# EAGLE design valoohj (EAGLE 7.2.0)
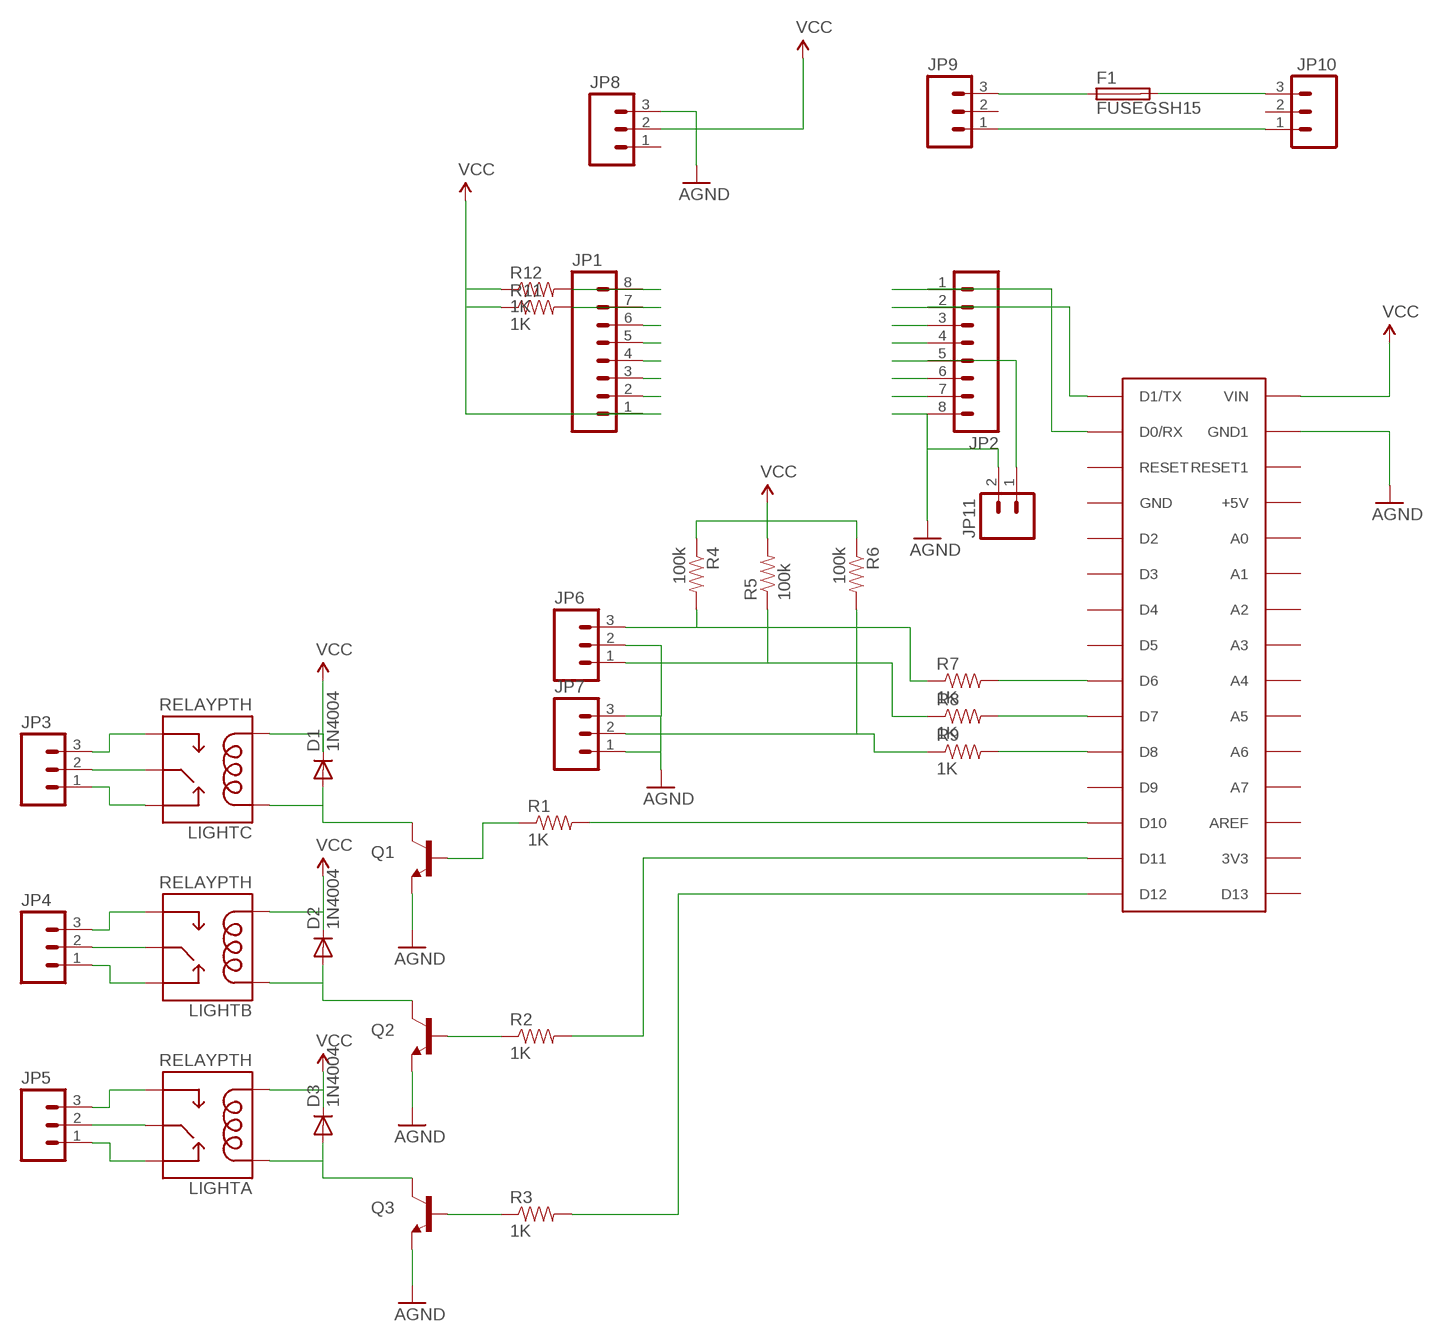
[diagram p0: schematic, sheet 1]

## Parts
D1  1N4004  [DO41-10]
D2  1N4004  [DO41-10]
D3  1N4004  [DO41-10]
F1  FUSEGSH15  [GSH15]
JP1  M08LONGPADS  [1X08_LONGPADS]
JP2  M08LONGPADS  [1X08_LONGPADS]
JP3  M03-SCREW-5MM  [SCREWTERMINAL-5MM-3]
JP4  M03-SCREW-5MM  [SCREWTERMINAL-5MM-3]
JP5  M03-SCREW-5MM  [SCREWTERMINAL-5MM-3]
JP6  M03-SCREW-5MM  [SCREWTERMINAL-5MM-3]
JP7  M03-SCREW-5MM  [SCREWTERMINAL-5MM-3]
JP8  M03SCREW  [SCREWTERMINAL-3.5MM-3]
JP9  M03SCREW  [SCREWTERMINAL-3.5MM-3]
JP10  M03SCREW  [SCREWTERMINAL-3.5MM-3]
JP11  M02LOCK  [1X02_LOCK]
LIGHTA  RELAYPTH  [SRD-05VDC-SL-C]
LIGHTB  RELAYPTH  [SRD-05VDC-SL-C]
LIGHTC  RELAYPTH  [SRD-05VDC-SL-C]
Q1  TRANSISTOR_NPNBC547  [TO-92-AMMO]
Q2  TRANSISTOR_NPNBC547  [TO-92-AMMO]
Q3  TRANSISTOR_NPNBC547  [TO-92-AMMO]
R1  1K  1KOHM-1/4W-1%(PTH)  [AXIAL-0.3]
R2  1K  1KOHM-1/4W-1%(PTH)  [AXIAL-0.3]
R3  1K  1KOHM-1/4W-1%(PTH)  [AXIAL-0.3]
R4  100k  1KOHM-1/4W-1%(PTH)  [AXIAL-0.3]
R5  100k  1KOHM-1/4W-1%(PTH)  [AXIAL-0.3]
R6  100k  1KOHM-1/4W-1%(PTH)  [AXIAL-0.3]
R7  1K  1KOHM-1/4W-1%(PTH)  [AXIAL-0.3]
R8  1K  1KOHM-1/4W-1%(PTH)  [AXIAL-0.3]
R9  1K  1KOHM-1/4W-1%(PTH)  [AXIAL-0.3]
R11  1K  1KOHM-1/4W-1%(PTH)  [AXIAL-0.3]
R12  1K  1KOHM-1/4W-1%(PTH)  [AXIAL-0.3]
U$2  ARDUINONANO  [PDIP-32]

## Nets
AGND: JP2.8 JP6.2 JP7.1 JP7.3 JP8.3 JP11.2 Q1.3(E) Q2.3(E) Q3.3(E) U$2.GND1
N$1: R2.P$2 U$2.D11
N$2: F1.2 JP10.3
N$3: F1.1 JP9.3
N$4: JP9.1 JP10.1
N$5: JP1.8 R12.P$2
N$6: JP1.7 R11.P$2
N$7: JP1.6
N$8: JP1.5
N$9: JP1.4
N$10: JP1.3
N$11: JP1.2
N$12: D1.A LIGHTC.COIL1 Q1.1(C)
N$13: JP2.1 U$2.D0/RX
N$14: JP2.2 U$2.D1/TX
N$15: JP2.3
N$16: JP2.4
N$17: JP2.5 JP11.1
N$18: JP2.6
N$19: JP2.7
N$20: D2.A LIGHTB.COIL1 Q2.1(C)
N$21: R1.P$2 U$2.D10
N$22: Q1.2(B) R1.P$1
N$23: D3.A LIGHTA.COIL1 Q3.1(C)
N$24: R9.P$2 U$2.D8
N$25: Q2.2(B) R2.P$1
N$26: Q3.2(B) R3.P$1
N$27: R3.P$2 U$2.D12
N$28: R8.P$2 U$2.D7
N$29: R7.P$2 U$2.D6
N$30: JP6.3 R4.P$2 R7.P$1
N$31: JP6.1 R5.P$1 R8.P$1
N$32: JP7.2 R6.P$2 R9.P$1
N$33: JP3.3 LIGHTC.SWOPEN
N$34: JP3.2 LIGHTC.SWCOMMON
N$35: JP3.1 LIGHTC.SWCLOSED(SWCLOSE)
N$36: JP4.3 LIGHTB.SWOPEN
N$37: JP4.2 LIGHTB.SWCOMMON
N$38: JP4.1 LIGHTB.SWCLOSED(SWCLOSE)
N$39: JP5.3 LIGHTA.SWOPEN
N$40: JP5.2 LIGHTA.SWCOMMON
N$41: JP5.1 LIGHTA.SWCLOSED(SWCLOSE)
VCC: D1.C D2.C D3.C JP1.1 JP8.2 LIGHTA.COIL0 LIGHTB.COIL0 LIGHTC.COIL0 R4.P$1 R5.P$2 R6.P$1 R11.P$1 R12.P$1 U$2.VIN
Unconnected: JP8.1 JP9.2 JP10.2 U$2.3V3 U$2.+5V U$2.A0 U$2.A1 U$2.A2 U$2.A3 U$2.A4 U$2.A5 U$2.A6 U$2.A7 U$2.AREF U$2.D2 U$2.D3 U$2.D4 U$2.D5 U$2.D9 U$2.D13 U$2.GND U$2.RESET U$2.RESET1

## Library data of the parts
D1-D3 = adafruit:1N4004: DIODE General purpose 1N400x type rectifier (With bigger pads) http://www.ladyada.net/library/pcb/eaglelibrary.html
F1 = fuse:FUSE: Fuse; OC_FARNELL: unknown; OC_NEWARK: unknown
JP1 JP2 = SparkFun-Connectors:M08: Header 8 Standard 8-pin 0.1" header. Use with straight break away headers (SKU : PRT-00116), right angle break away headers (PRT-00553), swiss pins (PRT-00743), machine pins (PRT-00117), and female headers (PRT-00115).
JP3-JP7 = SparkFun-Connectors:M03: Header 3 Standard 3-pin 0.1" header. Use with straight break away headers (SKU : PRT-00116), right angle break away headers (PRT-00553), swiss pins (PRT-00743), machine pins (PRT-00117), and female headers (PRT-00115). Molex polarized connector foot print use with SKU : PRT-08232 with associated crimp pins and housings.; STOREFRONT_ID: PRT-08433
JP8-JP10 = SparkFun-Connectors:M03: Header 3 Standard 3-pin 0.1" header. Use with straight break away headers (SKU : PRT-00116), right angle break away headers (PRT-00553), swiss pins (PRT-00743), machine pins (PRT-00117), and female headers (PRT-00115). Molex polarized connector foot print use with SKU : PRT-08232 with associated crimp pins and housings.
JP11 = SparkFun-Connectors:M02: Standard 2-pin 0.1" header. Use with - straight break away headers ( PRT-00116) - right angle break away headers (PRT-00553) - swiss pins (PRT-00743) - machine pins (PRT-00117) - female headers (PRT-00115) Molex polarized connector foot print use with: PRT-08233 with associated crimp pins and housings. 2.54_SCREWTERM for use with PRT-10571. 3.5mm Screw Terminal footprints for PRT-08084 5mm Screw Terminal footprints for use with PRT-08432
LIGHTA LIGHTB LIGHTC = SRD-05VDC-SL-C:RELAY: SPDT relay (COM-00101)
Q1-Q3 = SparkFun-DiscreteSemi:TRANSISTOR_NPN: Generic NPN BJT MMBT2222A - TRANS-08049 (SOT-23, 1A 40V) MPSA42 - TRANS-09116 (SOT-23, 500mA 300V) MMBT5088LT1G - TRANS-11160 (SOT-23, 50 mA 30V) BC547 - COM-08928 <http://www.sparkfun.com/products/8928> (TO-92 45V 100mA) (1.Collector 2.Base 3.Emitter) 2N3904 - COM-00521 <http://www.sparkfun.com/products/521> (TO-92 40V 200mA) (1.Emitter 2.Base 3.Collector) P2N2222A - COM-12852 <http://www.sparkfun.com/products/12852> (TO-92 40V 600mA) (1.Collector 2.Base 3.Emitter)
R1-R3 R7-R9 R11 R12 = SparkFun-Resistors:1KOHM-1/4W-1%(PTH): RES-12182; PROD_ID: RES-12182
R4-R6 = SparkFun-Resistors:1KOHM-1/4W-1%(PTH): RES-12182; PROD_ID: RES-12182; VALUE: 1K
U$2 = jet-lib:ARDUINONANO

## Board
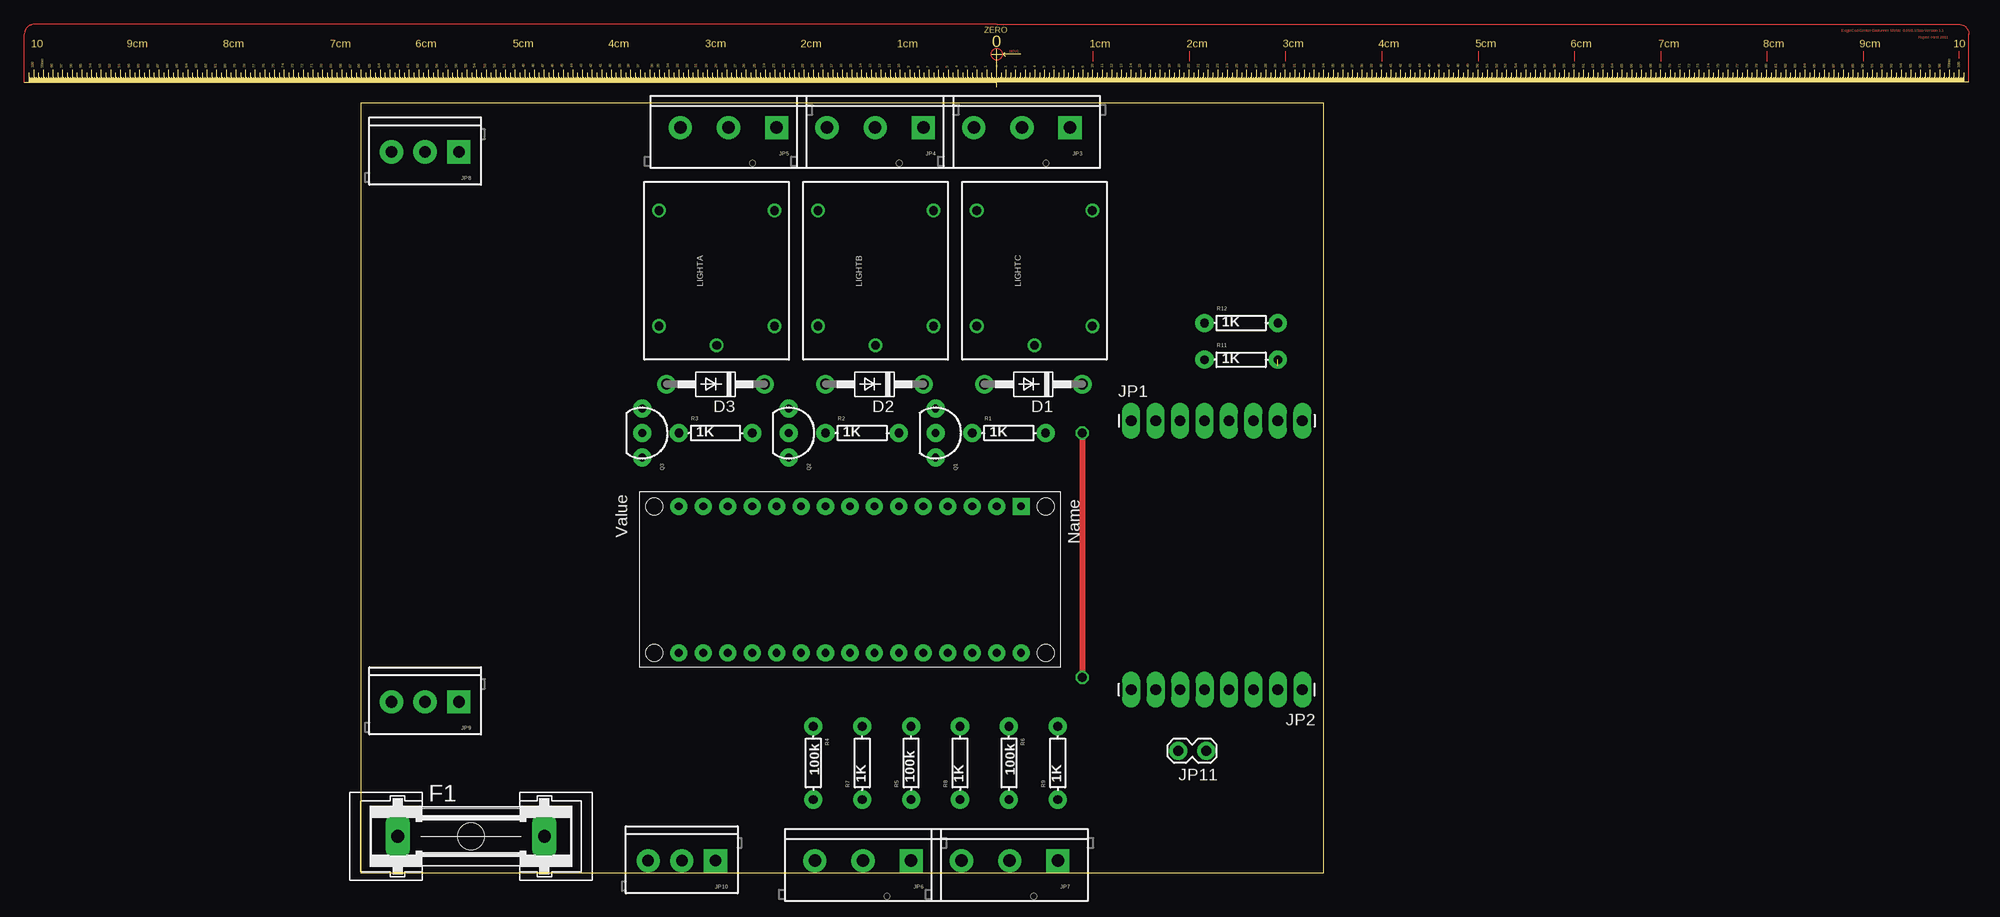
[diagram p1: board, top side]
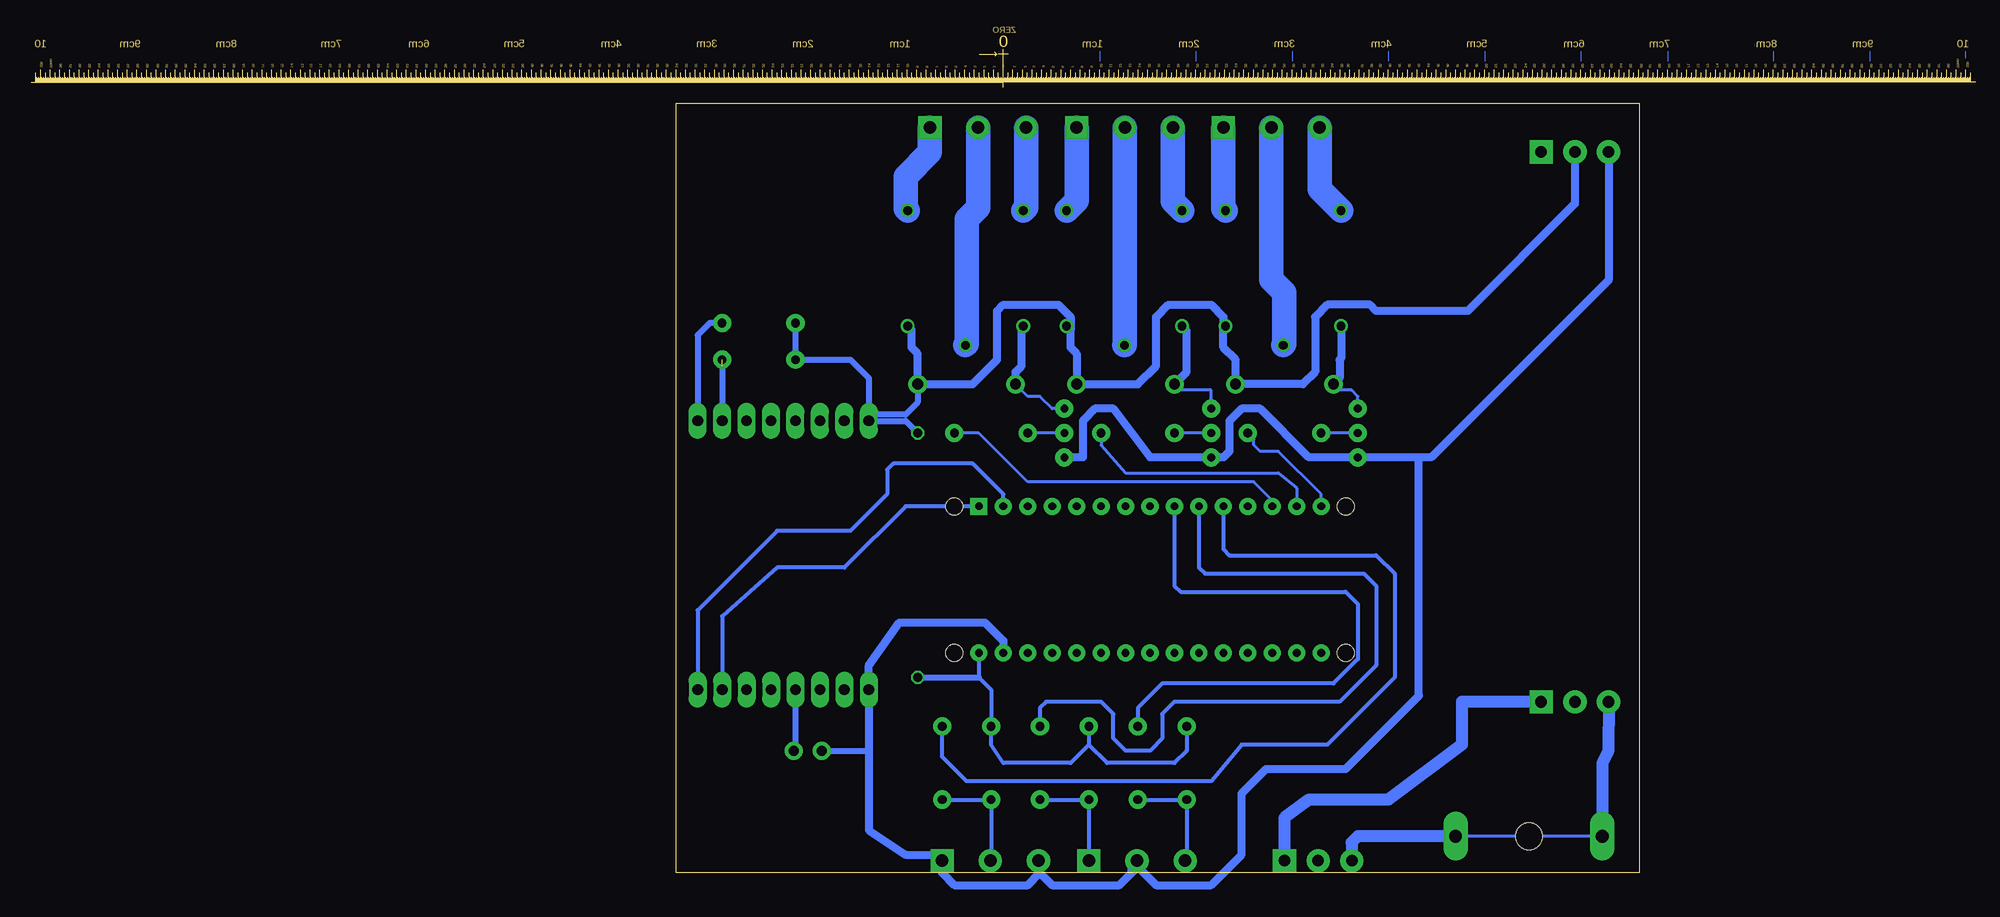
[diagram p2: board, bottom side, seen from below]

Size 100 x 80 mm. Coordinates in mm from the lower left corner, seen from the top.
Outline: 0,0 100,0 100,80 0,80 0,0
Copper layers (1*16): Top 0.035mm / dielectric 1.5mm / Bottom 0.035mm
Design rules "default": minimum track width 10mil, minimum drill 24mil, track to track 8mil, track to pad 8mil, pad to pad 8mil, via to via 8mil, smd to smd 8mil, copper to edge 40mil, drill to drill 8mil, minimum pad ring 10mil, minimum via ring 8mil, stop-mask expansion 4mil, vias tented up to drill 0mil, thermal gap 10mil

### Footprints (pad centres in the part's own frame; a part is rotated, then mirrored left to right if it is on the bottom)
DO41-10 = drill 1.118 pad 1.93: A 5.08,0; C -5.08,0
GSH15 = drill 1.321 pad 2.54 long: 1 -7.62,0; 2 7.62,0 | hole 2.794: 0,0
1X08_LONGPADS = drill 1.118 pad 1.88 long: 1 0,0; 2 2.54,0; 3 5.08,0; 4 7.62,0; 5 10.16,0; 6 12.7,0; 7 15.24,0; 8 17.78,0
SCREWTERMINAL-5MM-3 = drill 1.3 pad 2.413 square: 1 0,0 | drill 1.3 pad 2.413: 2 5,0; 3 10,0
SCREWTERMINAL-3.5MM-3 = drill 1.2 pad 2.413 square: 1 0,0 | drill 1.2 pad 2.413: 2 3.5,0; 3 7,0
1X02_LOCK = drill 1.016 pad 1.88: 1 -0.178,0; 2 2.718,0
SRD-05VDC-SL-C = drill 0.9: COIL0 -5.39,-6.12; COIL1 -5.39,5.88; SWCLOSED 6.61,-6.12; SWCOMMON -7.39,-0.12; SWOPEN 6.61,5.88
TO-92-AMMO = drill 0.813 pad 1.88: 1 -2.54,0; 2 0,0; 3 2.54,0
AXIAL-0.3 = drill 0.9 pad 1.88: P$1 -3.81,0; P$2 3.81,0
PDIP-32 = drill 0.8 pad 1.778: 3V3 15.24,-35.56; +5V 15.24,-10.16; A0 15.24,-12.7; A1 15.24,-15.24; A2 15.24,-17.78; A3 15.24,-20.32; A4 15.24,-22.86; A5 15.24,-25.4; A6 15.24,-27.94; A7 15.24,-30.48; AREF 15.24,-33.02; D0/RX 0,-5.08; D2 0,-12.7; D3 0,-15.24; D4 0,-17.78; D5 0,-20.32; D6 0,-22.86; D7 0,-25.4; D8 0,-27.94; D9 0,-30.48; D10 0,-33.02; D11 0,-35.56; D12 0,-38.1; D13 15.24,-38.1; GND 0,-10.16; GND1 15.24,-5.08; RESET 0,-7.62; RESET1 15.24,-7.62; VIN 15.24,-2.54 | drill 0.8 pad 1.778 square: D1/TX 0,-2.54 | hole 1.778: 0,0; 0,-40.64; 15.24,-40.64; 15.24,0

### Placement (x,y rotation side)
D1  69.85,50.8 180 top
D2  53.34,50.8 180 top
D3  36.83,50.8 180 top
F1  11.43,3.81 0 top
JP1  80.01,46.99 0 top
JP2  97.79,19.05 180 top
JP3  73.66,77.47 180 top
JP4  58.42,77.47 180 top
JP5  43.18,77.47 180 top
JP6  57.15,1.27 180 top
JP7  72.39,1.27 180 top
JP8  10.16,74.93 180 top
JP9  10.16,17.78 180 top
JP10  36.83,1.27 180 top
JP11  87.63,12.7 180 top
LIGHTA  36.83,62.23 90 top
LIGHTB  53.34,62.23 90 top
LIGHTC  69.85,62.23 90 top
Q1  59.69,45.72 270 top
Q2  44.45,45.72 270 top
Q3  29.21,45.72 270 top
R1  67.31,45.72 0 top
R2  52.07,45.72 0 top
R3  36.83,45.72 0 top
R4  46.99,11.43 270 top
R5  57.15,11.43 90 top
R6  67.31,11.43 270 top
R7  52.07,11.43 90 top
R8  62.23,11.43 90 top
R9  72.39,11.43 90 top
R11  91.44,53.34 0 top
R12  91.44,57.15 0 top
U$2  71.12,38.1 270 top
U$4  [RULER]  66.04,85.09 0 top  (outside the outline)

### Tracks (layer width: path | path; a pad name or v marks a point on that pad's centre or on a via)
AGND
  Bottom 0.61: JP11.2 80.01,12.7
  Bottom 0.813: JP8.3 3.16,61.61 21.59,43.18 22.86,43.18 | 22.86,43.18 Q3.3 34.29,43.18 39.37,48.26 41.27,48.26 42.55,46.99 42.55,43.81 43.18,43.18 Q2.3 50.8,43.18 54.61,48.26 56.52,48.26 57.78,46.99 57.78,43.18 Q1.3 | 62.23,0 62.23,1.11 | 62.23,1.11 JP7.3 62.39,0.16 62.23,0 | 52.7,0 53.98,-1.27 60.96,-1.27 62.23,0 | 52.7,0 52.7,0.71 JP6.2 | 62.23,0 63.5,-1.27 71.12,-1.27 72.39,0 JP7.1 73.03,1.91 76.2,1.91 80.01,4.45 80.01,12.7 JP2.8 80.01,21.59 76.83,26.04 67.94,26.04 66.04,24.13 U$2.GND1 | 62.23,1.27 62.23,1.11 | 52.7,0 52.07,0.64 50.16,-1.27 44.45,-1.27 41.27,1.91 41.27,8.26 38.73,10.79 30.48,10.79 22.86,18.41 22.86,43.18
N$1
  Bottom 0.305: R2.P$2 55.88,44.45 53.34,41.59 37.47,41.59 35.56,40.01 U$2.D11
N$2
  Bottom 1.27: F1.2 29.21,3.81 29.84,3.17 JP10.3
N$3
  Bottom 0.305: F1.1 19.05,3.81
  Bottom 1.27: JP9.3 3.17,12.7 3.81,11.43 F1.1 3.81,3.17
N$4
  Bottom 1.27: JP9.1 18.41,17.78 18.41,13.34 26.04,7.62 34.29,7.62 36.83,5.71 JP10.1
N$5
  Bottom 0.61: R12.P$2 96.52,57.15 97.79,55.88 JP1.8
N$6  (1 unrouted)
  Bottom 0.61: 95.25,52.7 JP1.7
N$12
  Bottom 0.305: Q1.1 60.96,48.26 62.23,49.53 63.5,49.53 D1.A
  Bottom 0.813: D1.A 64.77,52.07 64.14,52.7 64.14,56.67 LIGHTC.COIL1
N$13
  Bottom 0.406: U$2.D0/RX 66.04,39.37 69.22,42.55 77.47,42.55 78.11,41.91 78.11,39.37 81.92,35.56 89.53,35.56 97.79,27.3 JP2.1
N$14
  Bottom 0.406: U$2.D1/TX 76.2,38.1 82.55,31.75 89.53,31.75 95.25,26.67 JP2.2
N$17
  Bottom 0.61: JP2.5 87.63,12.88 JP11.1
N$20
  Bottom 0.305: Q2.1 44.45,50.16 47.62,50.16 D2.A
  Bottom 0.813: D2.A 46.99,52.07 46.99,56.37 LIGHTB.COIL1
N$21
  Bottom 0.305: U$2.D10 38.1,38.73 40.01,40.64 63.5,40.64 68.58,45.72 R1.P$2
N$22
  Bottom 0.305: Q1.2 R1.P$1
N$23
  Bottom 0.305: Q3.1 29.21,49.53 29.84,50.16 31.11,50.16 D3.A
  Bottom 0.813: LIGHTA.COIL1 30.95,53.51 31.11,53.34 31.11,51.44 D3.A
N$24
  Bottom 0.406: U$2.D8 43.18,33.66 42.55,33.02 27.3,33.02 25.4,31.11 25.4,20.32 32.38,13.34 41.27,13.34 44.45,9.53 69.85,9.53 72.39,12.06 R9.P$2
N$25
  Bottom 0.305: Q2.2 R2.P$1
N$26
  Bottom 0.305: Q3.2 R3.P$1
N$27
  Bottom 0.305: U$2.D12 33.02,39.37 37.47,43.81 39.37,43.81 40.01,44.45 40.01,45.09 R3.P$2
N$28
  Bottom 0.406: U$2.D7 45.72,31.75 45.09,31.11 28.57,31.11 27.3,29.84 27.3,21.59 31.11,17.78 48.26,17.78 49.53,16.51 49.53,13.97 50.8,12.7 53.34,12.7 54.61,13.97 54.61,16.51 55.88,17.78 61.59,17.78 62.23,17.14 R8.P$2
N$29
  Bottom 0.406: U$2.D6 48.26,29.84 47.62,29.21 30.48,29.21 29.21,27.94 29.21,22.23 31.75,19.68 49.53,19.68 52.07,17.14 R7.P$2
N$30
  Bottom 0.406: R7.P$1 R4.P$2 46.99,1.43 JP6.3
N$31
  Bottom 0.406: R8.P$1 R5.P$1 JP6.1
N$32
  Bottom 0.406: R9.P$1 R6.P$2 67.31,1.35 JP7.2
N$33
  Bottom 2.54: JP3.3 63.66,69.15 LIGHTC.SWOPEN
N$34
  Bottom 2.54: JP3.2 68.66,69.14 69.85,67.94 69.85,54.96 LIGHTC.SWCOMMON
N$35
  Bottom 2.54: JP3.1 73.66,74.93 76.2,72.39 76.2,69.07 LIGHTC.SWCLOSED
N$36
  Bottom 2.54: JP4.3 48.42,69.8 LIGHTB.SWOPEN
N$37
  Bottom 2.54: JP4.2 53.42,54.88 LIGHTB.SWCOMMON
N$38
  Bottom 2.54: JP4.1 58.42,69.88 LIGHTB.SWCLOSED
N$39
  Bottom 2.54: JP5.3 33.18,71.07 LIGHTA.SWOPEN
N$40
  Bottom 2.54: JP5.2 38.18,61.67 36.83,60.33 36.83,54.96 LIGHTA.SWCOMMON
N$41
  Bottom 2.54: JP5.1 43.18,69.07 LIGHTA.SWCLOSED
VCC  (via drill 0.9)
  Top 0.61: v74.93,45.72 v74.93,20.32
  Bottom 0.406: U$2.VIN 68.58,20.32 67.31,19.05 R6.P$1 67.31,13.34 66.04,11.43 59.05,11.43 57.15,13.34 | R5.P$2 57.15,13.34 | R4.P$1 46.99,12.7 48.26,11.43 55.24,11.43 57.15,13.34
  Bottom 0.61: D1.C 74.93,48.9 76.2,47.62 79.38,47.62 JP1.1 | JP1.1 79.38,46.99 | R12.P$1 R11.P$1 81.92,53.34 80.01,51.44 JP1.1 | JP1.1 76.2,46.99 v74.93,45.72 | v74.93,20.32 68.58,20.32
  Bottom 0.813: JP8.2 6.66,69.54 17.78,58.42 27.3,58.42 27.94,59.05 32.38,59.05 33.66,57.78 33.66,52.07 34.92,50.8 D3.C 41.91,53.34 43.18,54.61 43.18,56.61 LIGHTA.COIL0 43.18,57.07 43.18,57.78 44.45,59.05 48.9,59.05 50.16,57.78 50.16,52.7 52.07,50.8 D2.C 58.42,53.98 59.05,54.61 59.05,56.44 | 59.05,56.44 LIGHTB.COIL0 | LIGHTC.COIL0 75.56,56.44 75.56,54.61 74.93,53.98 D1.C 69.22,50.8 66.67,53.34 66.67,58.42 66.04,59.05 60.33,59.05 59.05,57.78 59.05,56.44